# EAGLE schematic lm3410-sepic (EAGLE 6.4)
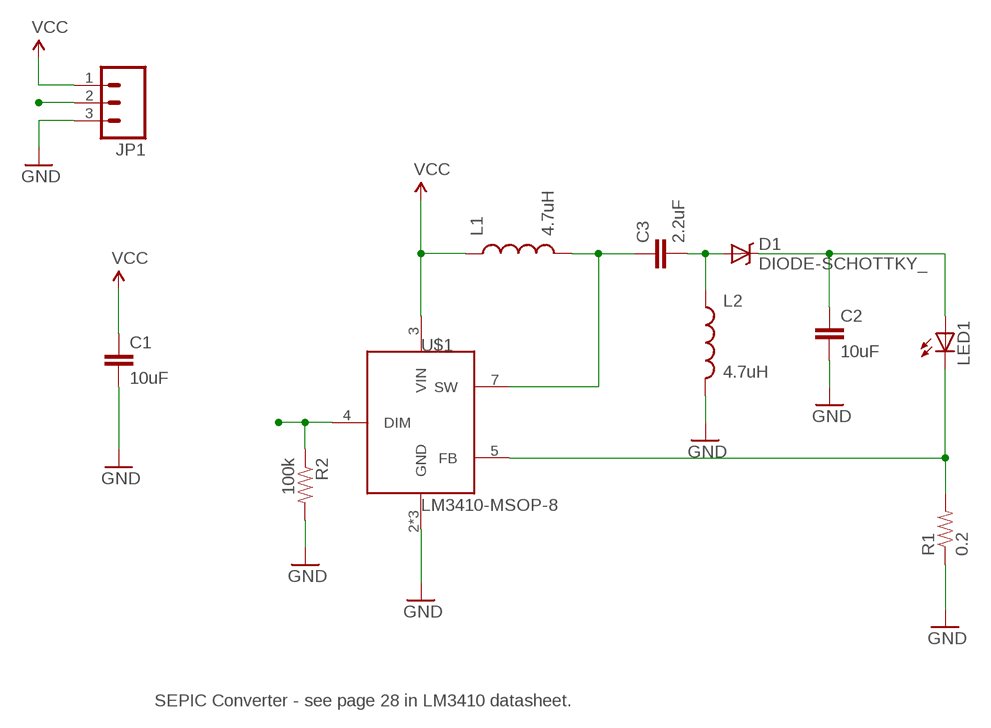
[diagram p0: schematic, sheet 1]

## Parts
C1  10uF  CAP0805  [0805]
C2  10uF  CAP1206  [1206]
C3  2.2uF  CAP1206  [1206]
D1  DIODE-SCHOTTKY_  [SMA-DIODE]
JP1  M03PTH  [1X03]
L1  4.7uH  INDUCTOR1210  [1210]
L2  4.7uH  INDUCTOR1210  [1210]
LED1  LED5MM  [LED5MM]
R1  0.2  RESISTOR1206  [1206]
R2  100k  RESISTOR0805-RES  [0805]
U$1  LM3410-MSOP-8  [MSOP-8]

## Nets
DIM: JP1.2 R2.1 U$1.4(DIM)
GND: C1.2 C2.2 JP1.3 L2.2 R1.1 R2.2 U$1.2(GND) U$1.6(GND) U$1.9(GND)
N$6: LED1.K(C) R1.2 U$1.5(FB)
N$8: C3.1 L1.2 U$1.7(SW)
N$9: C3.2 D1.A L2.1
N$12: C2.1 D1.C LED1.A
VCC: C1.1 JP1.1 L1.1 U$1.3(VIN)

## Notes on the sheet
- SEPIC Converter - see page 28 in LM3410 datasheet.

## Library data of the parts
C1-C3 = SparkFun-Capacitors:CAP: Capacitor Standard 0603 ceramic capacitor, and 0.1" leaded capacitor.
D1 = SparkFun-DiscreteSemi:DIODE-SCHOTTKY: Commonly MBRA140.
JP1 = SparkFun-Connectors:M03: Header 3 Standard 3-pin 0.1" header. Use with straight break away headers (SKU : PRT-00116), right angle break away headers (PRT-00553), swiss pins (PRT-00743), machine pins (PRT-00117), and female headers (PRT-00115). Molex polarized connector foot print use with SKU : PRT-08232 with associated crimp pins and housings.
L1 L2 = SparkFun-Passives:INDUCTOR: Inductors Basic Inductor/Choke - 0603 and 1206. Footprints are not proven and vary greatly between part numbers.
LED1 = SparkFun-LED:LED: LEDs Standard schematic elements and footprints for 5mm, 3mm, 1206, and 0603 sized LEDs. 5mm - Spark Fun Electronics SKU : COM-00529 (and others)
R1 R2 = SparkFun-Resistors:RESISTOR: Resistor Basic schematic elements and footprints for 0603, 1206, and PTH resistors.
U$1 = Synapseware:LM3410: LM3410/LM3410Q 525kHz/1.6MHz, Constant Current Boost and SEPIC LED Driver with Internal Compensation